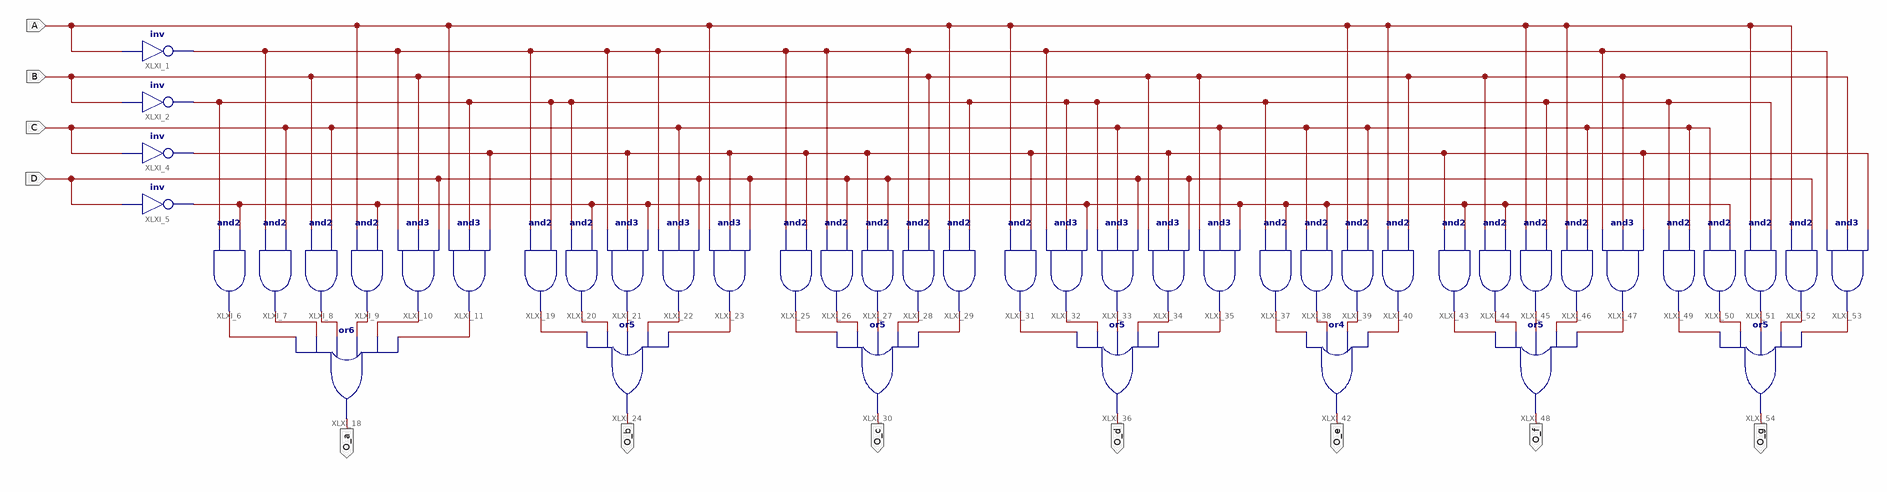
[diagram p0: schematic sheet 1]
// Xilinx ISE schematic BCD_to_7Segment(ใช้กับlab7).sch (spartan6) as structural Verilog: 46 symbols, 11 ports
module \BCD_to_7Segment(ใช้กับlab7)  (
  input  A,
  input  B,
  input  C,
  input  D,
  output O_a,
  output O_b,
  output O_c,
  output O_d,
  output O_e,
  output O_f,
  output O_g
);

  wire A_Bar, B_Bar, C_Bar, D_Bar, XLXN_12, XLXN_13, XLXN_14, XLXN_15, XLXN_16, XLXN_18, XLXN_29, XLXN_30,
       XLXN_31, XLXN_32, XLXN_33, XLXN_35, XLXN_36, XLXN_37, XLXN_38, XLXN_39, XLXN_41, XLXN_42, XLXN_43,
       XLXN_44, XLXN_45, XLXN_51, XLXN_52, XLXN_53, XLXN_54, XLXN_56, XLXN_57, XLXN_58, XLXN_59, XLXN_60,
       XLXN_62, XLXN_63, XLXN_64, XLXN_65, XLXN_66;

  not XLXI_1 (A_Bar, A);
  not XLXI_2 (B_Bar, B);
  not XLXI_4 (C_Bar, C);
  not XLXI_5 (D_Bar, D);
  and XLXI_6 (XLXN_12, B_Bar, D_Bar);
  and XLXI_7 (XLXN_13, A_Bar, C);
  and XLXI_8 (XLXN_14, B, C);
  and XLXI_9 (XLXN_15, A, D_Bar);
  and XLXI_10 (XLXN_16, A_Bar, B, D);
  and XLXI_11 (XLXN_18, A, B_Bar, C_Bar);
  or XLXI_18 (O_a, XLXN_12, XLXN_13, XLXN_14, XLXN_15, XLXN_16, XLXN_18);
  and XLXI_19 (XLXN_29, A_Bar, B_Bar);
  and XLXI_20 (XLXN_30, B_Bar, D_Bar);
  and XLXI_21 (XLXN_31, A_Bar, C_Bar, D_Bar);
  and XLXI_22 (XLXN_32, A_Bar, C, D);
  and XLXI_23 (XLXN_33, A, C_Bar, D);
  or XLXI_24 (O_b, XLXN_29, XLXN_30, XLXN_31, XLXN_32, XLXN_33);
  and XLXI_25 (XLXN_35, A_Bar, C_Bar);
  and XLXI_26 (XLXN_36, A_Bar, D);
  and XLXI_27 (XLXN_37, C_Bar, D);
  and XLXI_28 (XLXN_38, A_Bar, B);
  and XLXI_29 (XLXN_39, A, B_Bar);
  or XLXI_30 (O_c, XLXN_35, XLXN_36, XLXN_37, XLXN_38, XLXN_39);
  and XLXI_31 (XLXN_41, A, C_Bar);
  and XLXI_32 (XLXN_42, A_Bar, B_Bar, D_Bar);
  and XLXI_33 (XLXN_43, B_Bar, C, D);
  and XLXI_34 (XLXN_44, B, C_Bar, D);
  and XLXI_35 (XLXN_45, B, C, D_Bar);
  or XLXI_36 (O_d, XLXN_41, XLXN_42, XLXN_43, XLXN_44, XLXN_45);
  and XLXI_37 (XLXN_51, B_Bar, D_Bar);
  and XLXI_38 (XLXN_52, C, D_Bar);
  and XLXI_39 (XLXN_53, A, C);
  and XLXI_40 (XLXN_54, A, B);
  or XLXI_42 (O_e, XLXN_51, XLXN_52, XLXN_53, XLXN_54);
  and XLXI_43 (XLXN_56, C_Bar, D_Bar);
  and XLXI_44 (XLXN_57, B, D_Bar);
  and XLXI_45 (XLXN_58, A, B_Bar);
  and XLXI_46 (XLXN_59, A, C);
  and XLXI_47 (XLXN_60, A_Bar, B, C_Bar);
  or XLXI_48 (O_f, XLXN_56, XLXN_57, XLXN_58, XLXN_59, XLXN_60);
  and XLXI_49 (XLXN_62, B_Bar, C);
  and XLXI_50 (XLXN_63, C, D_Bar);
  and XLXI_51 (XLXN_64, A, B_Bar);
  and XLXI_52 (XLXN_65, A, D);
  and XLXI_53 (XLXN_66, A_Bar, B, C_Bar);
  or XLXI_54 (O_g, XLXN_62, XLXN_63, XLXN_64, XLXN_65, XLXN_66);
endmodule
